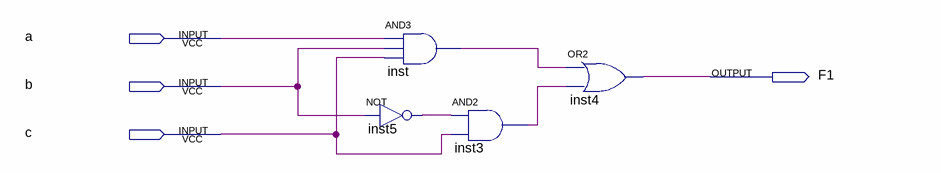
[diagram p0: schematic sheet]
// Quartus schematic Sistema01.bdf as structural Verilog: 4 symbols, 4 pins
module Sistema01 (
  input  a,
  input  b,
  input  c,
  output F1
);

  wire inst3_out, inst5_out, inst_out;

  and inst (inst_out, a, b, c);
  not inst5 (inst5_out, b);
  and inst3 (inst3_out, inst5_out, c);
  or inst4 (F1, inst_out, inst3_out);
endmodule
